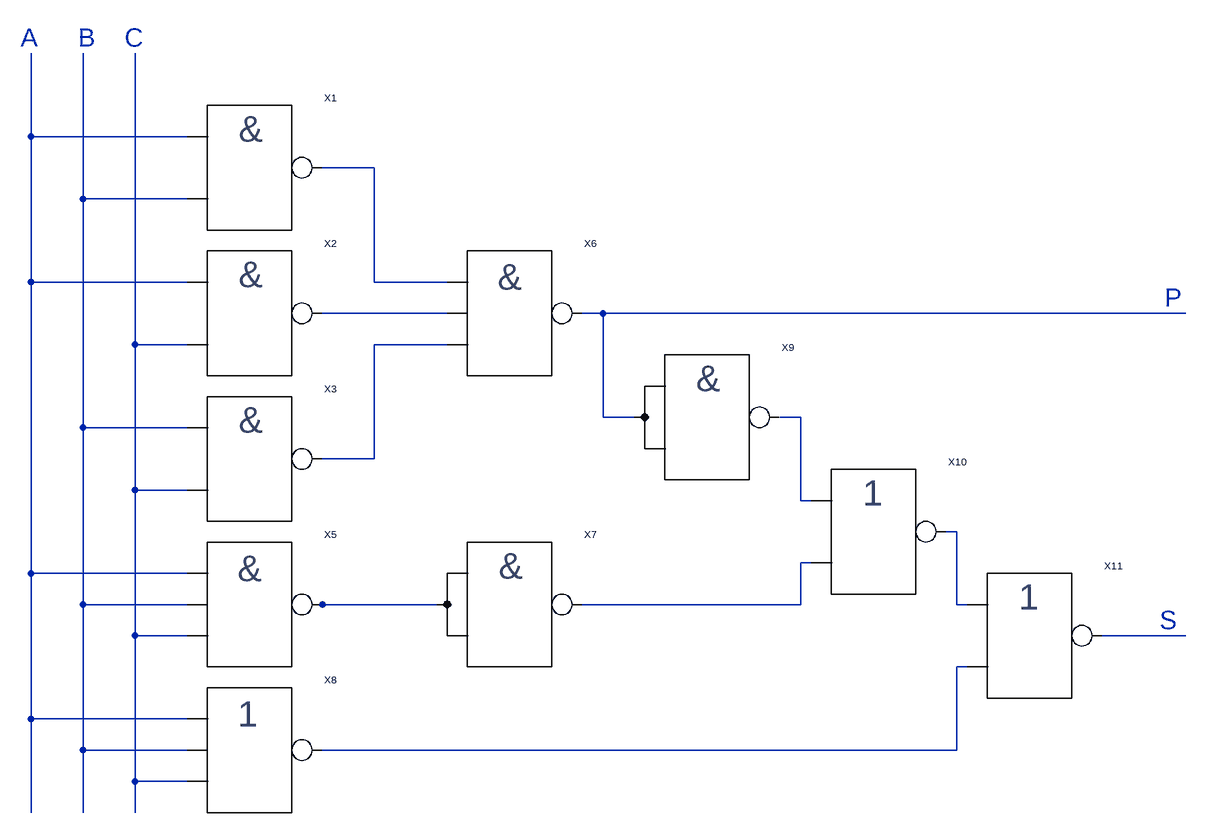
[diagram p0: schematic SM.asc]
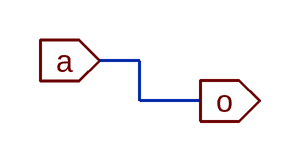
[diagram p1: sub-circuit nand1.asc]
SM.asc, the LTspice schematic file:
Version 4
SHEET 1 1572 1124
WIRE -208 80 -208 -48
WIRE 32 80 -208 80
WIRE 320 128 240 128
WIRE -128 176 -128 -48
WIRE 32 176 -128 176
WIRE -208 304 -208 80
WIRE 32 304 -208 304
WIRE 320 304 320 128
WIRE 432 304 320 304
WIRE 432 352 240 352
WIRE 672 352 640 352
WIRE 1568 352 672 352
WIRE -48 400 -48 -48
WIRE 32 400 -48 400
WIRE 432 400 320 400
WIRE 672 512 672 352
WIRE 720 512 672 512
WIRE 976 512 944 512
WIRE -128 528 -128 176
WIRE 32 528 -128 528
WIRE 320 576 320 400
WIRE 320 576 240 576
WIRE -48 624 -48 400
WIRE 32 624 -48 624
WIRE 976 640 976 512
WIRE 992 640 976 640
WIRE 1216 688 1200 688
WIRE 992 736 976 736
WIRE -208 752 -208 304
WIRE 32 752 -208 752
WIRE -128 800 -128 528
WIRE 32 800 -128 800
WIRE 240 800 224 800
WIRE 416 800 240 800
WIRE 976 800 976 736
WIRE 976 800 640 800
WIRE 1216 800 1216 688
WIRE 1232 800 1216 800
WIRE -48 848 -48 624
WIRE 32 848 -48 848
WIRE 1568 848 1440 848
WIRE 1232 896 1216 896
WIRE -208 976 -208 752
WIRE 32 976 -208 976
WIRE -128 1024 -128 800
WIRE 32 1024 -128 1024
WIRE 1216 1024 1216 896
WIRE 1216 1024 240 1024
WIRE -48 1072 -48 848
WIRE 32 1072 -48 1072
WIRE -208 1120 -208 976
WIRE -128 1120 -128 1024
WIRE -48 1120 -48 1072
SYMBOL NAND2 128 128 R0
SYMATTR InstName X1
SYMBOL NAND2 128 352 R0
SYMATTR InstName X2
SYMBOL NAND2 128 576 R0
SYMATTR InstName X3
SYMBOL NAND3 128 800 R0
SYMATTR InstName X5
SYMBOL NAND3 528 352 R0
SYMATTR InstName X6
SYMBOL NAND1 528 800 R0
SYMATTR InstName X7
SYMBOL NOR3 128 1024 R0
SYMATTR InstName X8
SYMBOL NAND1 832 512 R0
SYMATTR InstName X9
SYMBOL NOR2 1088 688 R0
SYMATTR InstName X10
SYMBOL NOR2 1328 848 R0
SYMATTR InstName X11
TEXT 1536 328 Left 4 ;P
TEXT 1528 824 Left 4 ;S
TEXT -224 -72 Left 4 ;A
TEXT -136 -72 Left 4 ;B
TEXT -64 -72 Left 4 ;C

nand1.asc, the sub-circuit schematic file:
Version 4
SHEET 1 880 680
WIRE 96 80 64 80
WIRE 96 112 96 80
WIRE 144 112 96 112
FLAG 64 80 a
IOPIN 64 80 In
FLAG 144 112 o
IOPIN 144 112 Out

The netlist it stands for:
* SM.asc
XX1 N001 N003 N002 NAND2  ; pins a b o
XX2 N001 N006 N004 NAND2  ; pins a b o
XX3 N003 N006 N007 NAND2  ; pins a b o
XX5 N001 N006 N011 N003 NAND3  ; pins a b o c
XX6 N002 N007 N005 N004 NAND3  ; pins a b o c
XX7 N011 N010 nand1
XX8 N001 N006 N013 N003 NOR3  ; pins a b o c
XX9 N005 N008 nand1
XX10 N008 N010 N009 NOR2  ; pins a b o
XX11 N009 N013 N012 NOR2  ; pins a b o

* block symbol definitions
.subckt nand1 a o
.ends nand1

* P
* S
* A
* B
* C
.backanno
.end